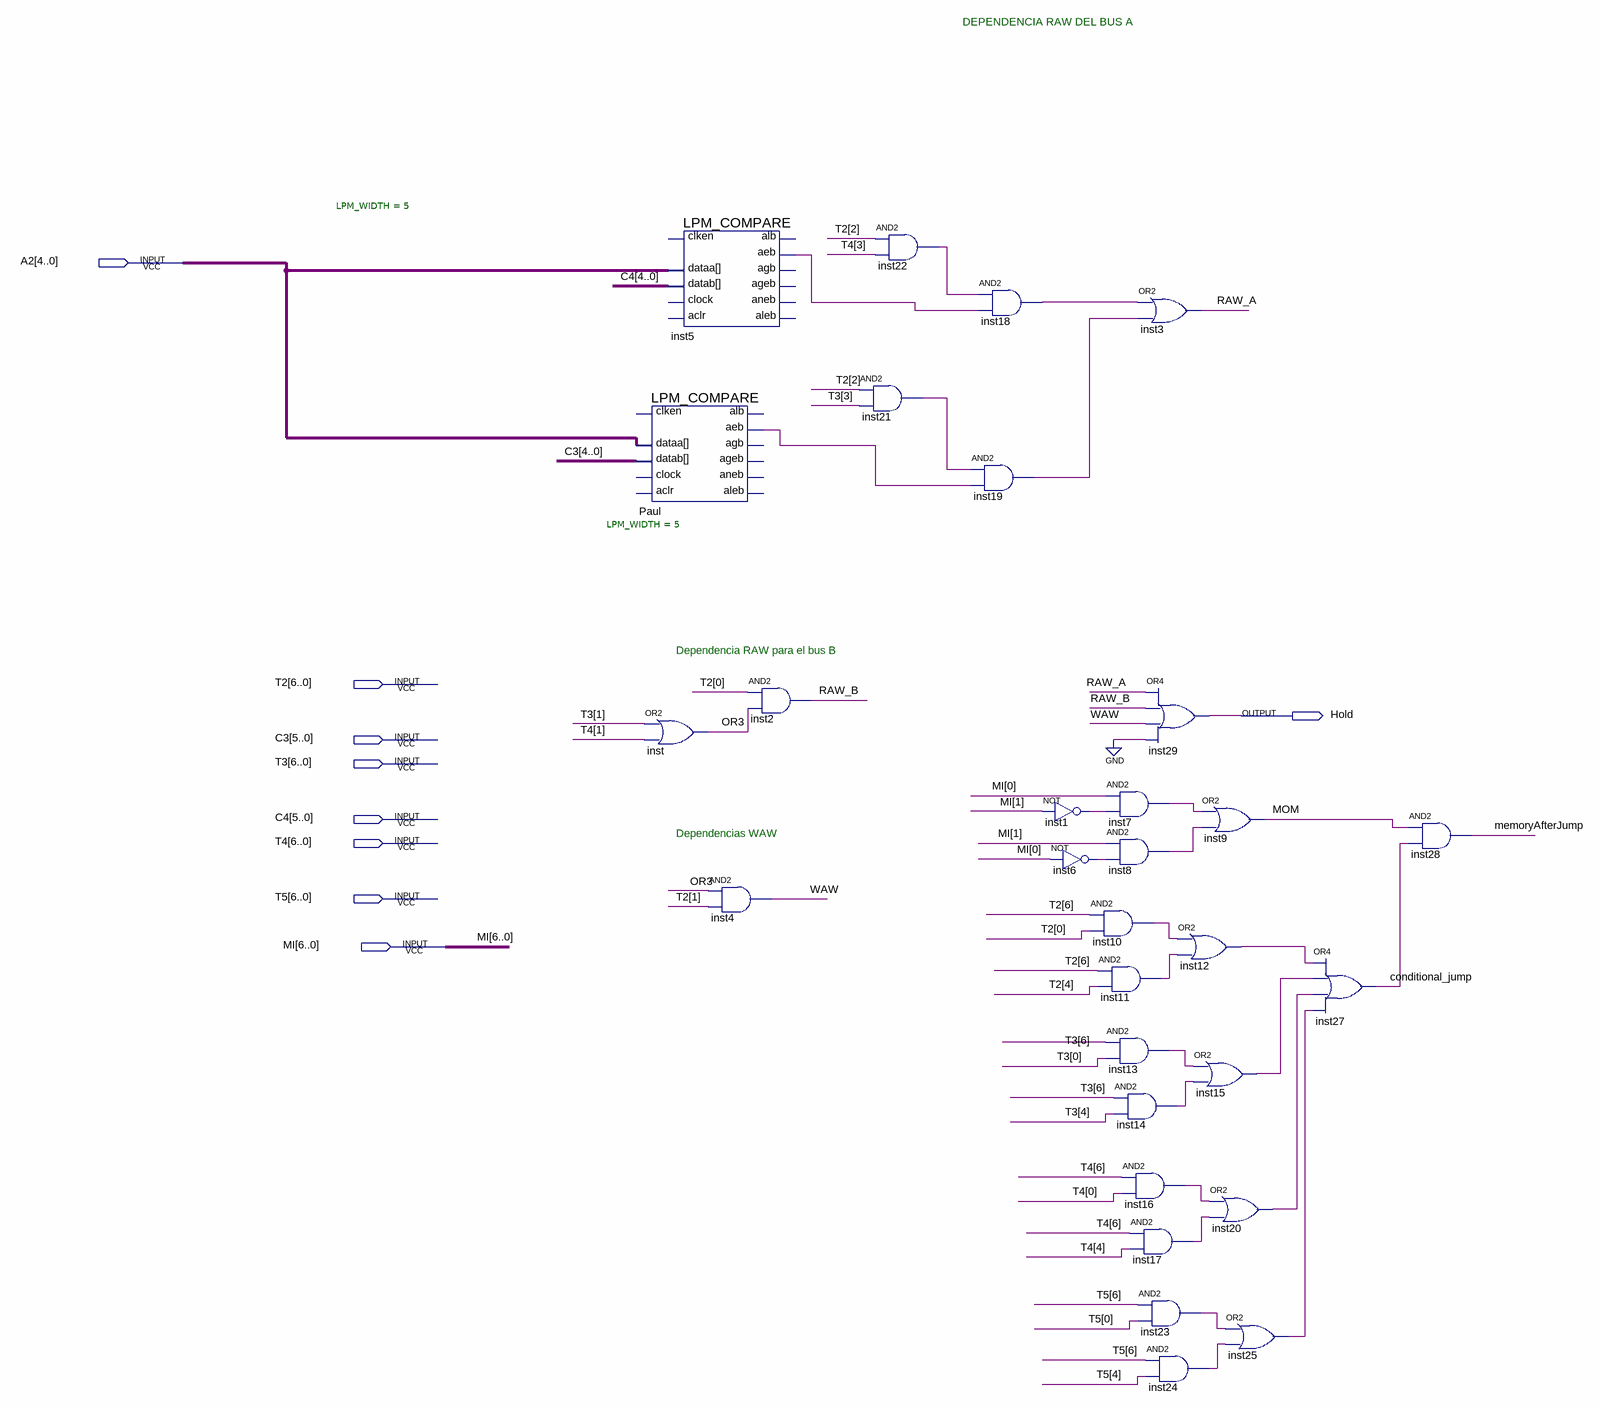
[diagram p0: schematic sheet]
// Quartus schematic UC2.bdf as structural Verilog: 30 symbols, 9 pins
module UC2 (
  input  [4:0] A2,
  input  [6:0] T2,
  input  [5:0] C3,
  input  [6:0] T3,
  input  [5:0] C4,
  input  [6:0] T4,
  input  [6:0] T5,
  input  [6:0] MI,
  output Hold
);

  wire conditional_jump, inst1_out, inst5_aeb, inst6_out, inst7_out, inst8_out, inst10_out, inst11_out,
       inst12_out, inst13_out, inst14_out, inst15_out, inst16_out, inst17_out, inst18_out, inst19_out,
       inst20_out, inst21_out, inst22_out, inst23_out, inst24_out, inst25_out, memoryAfterJump, MOM, OR3,
       Paul_aeb, RAW_A, RAW_B, WAW;

  LPM_COMPARE #(.LPM_WIDTH(5)) inst5 (
    .dataa(A2), .datab(C4[4:0]), .aeb(inst5_aeb));  // open: clock, aclr, clken, aleb, agb, aneb, ageb, alb
  LPM_COMPARE #(.LPM_WIDTH(5)) Paul (
    .dataa(A2), .datab(C3[4:0]), .aeb(Paul_aeb));  // open: clock, aclr, clken, aleb, agb, aneb, ageb, alb
  or inst (OR3, T3[1], T4[1]);
  and inst4 (WAW, OR3, T2[1]);
  and inst2 (RAW_B, T2[0], OR3);
  and inst21 (inst21_out, T2[2], T3[3]);
  and inst22 (inst22_out, T2[2], T4[3]);
  and inst18 (inst18_out, inst22_out, inst5_aeb);
  and inst19 (inst19_out, inst21_out, Paul_aeb);
  not inst1 (inst1_out, MI[1]);
  not inst6 (inst6_out, MI[0]);
  and inst7 (inst7_out, MI[0], inst1_out);
  and inst8 (inst8_out, MI[1], inst6_out);
  and inst10 (inst10_out, T2[6], T2[0]);
  and inst11 (inst11_out, T2[6], T2[4]);
  and inst13 (inst13_out, T3[6], T3[0]);
  and inst14 (inst14_out, T3[6], T3[4]);
  and inst16 (inst16_out, T4[6], T4[0]);
  or inst3 (RAW_A, inst18_out, inst19_out);
  or inst29 (Hold, RAW_A, RAW_B, WAW, 1'b0);
  or inst12 (inst12_out, inst10_out, inst11_out);
  and inst17 (inst17_out, T4[6], T4[4]);
  and inst23 (inst23_out, T5[6], T5[0]);
  and inst24 (inst24_out, T5[6], T5[4]);
  or inst9 (MOM, inst7_out, inst8_out);
  or inst15 (inst15_out, inst13_out, inst14_out);
  or inst20 (inst20_out, inst16_out, inst17_out);
  or inst25 (inst25_out, inst23_out, inst24_out);
  or inst27 (conditional_jump, inst12_out, inst15_out, inst20_out, inst25_out);
  and inst28 (memoryAfterJump, MOM, conditional_jump);

  // Notes on the sheet:
  //   DEPENDENCIA RAW DEL BUS A
  //   Dependencia RAW para el bus B
  //   Dependencias WAW
endmodule
